# Altium project FIT_PM_Digital_Readout_test_board.PrjPcb (part 4 of 4)

## Sheet TDC_VTUNE_DAC.SchDoc: FMC 5GS/s ADC/TDC
size 420 x 297 mm; DrawnBy: A. Bartkowicz; Engineer: A. Bartkowicz; Revision: 1; SheetNumber: 8; SheetTotal: 13; ModifiedBy: -; CheckedDate: -; Title2: DAC circuit for Varicaps; DivGrp: WUT ISE; Designer: A. Bartkowicz
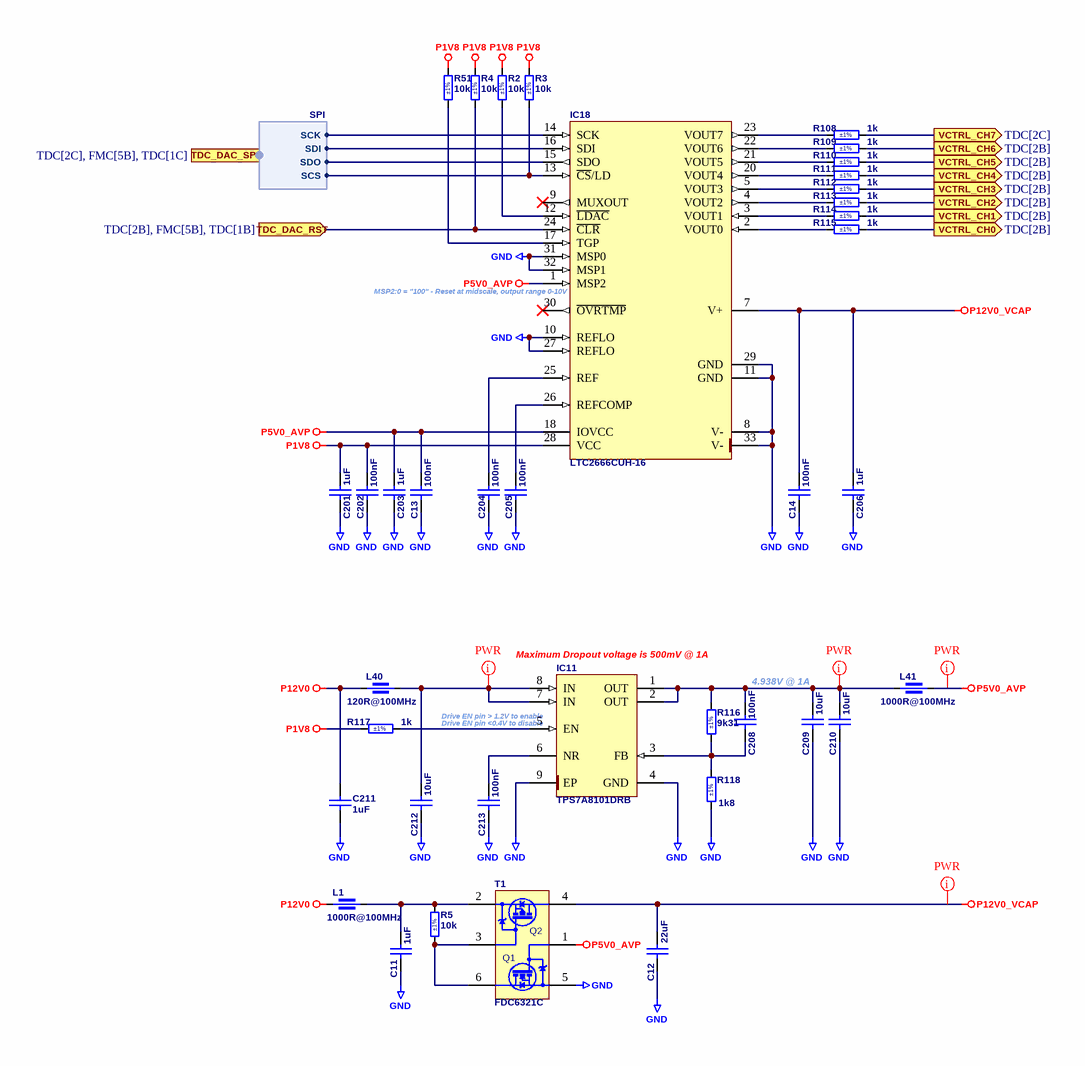
[diagram p11: TDC_VTUNE_DAC.SchDoc]

### Parts
C11  1uF  [CAPC1005X55N]
C12  22uF  [CAPC2012X135N]
C13  100nF  [CAPC1005X55N]
C14  100nF  [CAPC1005X55N]
C201  1uF  [CAPC1608X87N]
C202  100nF  [CAPC1005X55N]
C203  1uF  [CAPC1608X87N]
C204  100nF  [CAPC1005X55N]
C205  100nF  [CAPC1005X55N]
C206  1uF  [CAPC1608X87N]
C208  100nF  [CAPC1005X55N]
C209  10uF  [CAPC1608X90N]
C210  10uF  [CAPC1608X90N]
C211  1uF  [CAPC1005X55N]
C212  10uF  [CAPC1608X90N]
C213  100nF  [CAPC1005X55N]
IC11  TPS7A8101DRB  [TEXAS_DRB(S-PVSON-N8)]
IC18  LTC2666CUH-16  [QFN50P500X500X80-33N-S355]
L1  1000R@100MHz  [INDC1608X95N]
L40  120R@100MHz  [INDC1005X55N]
L41  1000R@100MHz  [INDC1608X95N]
R2  10k  Tolerance: ±1%  [RESC1005X40N]
R3  10k  Tolerance: ±1%  [RESC1005X40N]
R4  10k  Tolerance: ±1%  [RESC1005X40N]
R5  10k  Tolerance: ±1%  [RESC1005X40N]
R51  10k  Tolerance: ±1%  [RESC1005X40N]
R108  1k  Tolerance: ±1%  [RESC1005X40N]
R109  1k  Tolerance: ±1%  [RESC1005X40N]
R110  1k  Tolerance: ±1%  [RESC1005X40N]
R111  1k  Tolerance: ±1%  [RESC1005X40N]
R112  1k  Tolerance: ±1%  [RESC1005X40N]
R113  1k  Tolerance: ±1%  [RESC1005X40N]
R114  1k  Tolerance: ±1%  [RESC1005X40N]
R115  1k  Tolerance: ±1%  [RESC1005X40N]
R116  9k31  Tolerance: ±1%  [RESC1005X40N]
R117  1k  Tolerance: ±1%  [RESC1005X40N]
R118  1k8  Tolerance: ±1%  [RESC1005X40N]
T1  FDC6321C  [SOT95P280X110-6N]

### Ports
TDC_DAC_RST (in, see TDC[2B], FMC[5B], TDC[1B]), TDC_DAC_SPI (in, harness SPI, see TDC[2C], FMC[5B], TDC[1C]), VCTRL_CH0 (out, see TDC[2B]), VCTRL_CH1 (out, see TDC[2B]), VCTRL_CH2 (out, see TDC[2B]), VCTRL_CH3 (out, see TDC[2B]), VCTRL_CH4 (out, see TDC[2B]), VCTRL_CH5 (out, see TDC[2B]), VCTRL_CH6 (out, see TDC[2B]), VCTRL_CH7 (out, see TDC[2C])

### Harnesses
SPI: SDI, SDO, SCK, SCS

### Nets
GND: C11.1 C12.1 C13.1 C14.1 C201.1 C202.1 C203.1 C204.1 C205.1 C206.1 C209.1 C210.1 C211.1 C212.1 C213.1 IC11.4(GND) IC11.9(EP) IC18.8(V-) IC18.10(REFLO) IC18.11(GND) IC18.27(REFLO) IC18.29(GND) IC18.31(MSP0) IC18.32(MSP1) IC18.33(V-) R118.1 T1.5(S1)
P1V8: C201.2 C202.2 IC18.28(VCC) R2.2 R3.2 R4.2 R51.2 R117.1
P5V0_AVP: C13.2 C203.2 IC18.1(MSP2) IC18.18(IOVCC) L41.2 T1.1(G1)
P12V0: C211.2 L1.1 L40.1
P12V0_VCAP: C12.2 C14.2 C206.2 IC18.7(V+) T1.4(D2)
HA14_P: IC18.16(SDI) ; port TDC_DAC_SPI.SDI
HA15_P: IC18.15(SDO) ; port TDC_DAC_SPI.SDO
HA17_CC_P: IC18.14(SCK) ; port TDC_DAC_SPI.SCK
HA22_P: IC18.24(~{CLR}) R4.1 ; port TDC_DAC_RST
HA23_P: IC18.13(~{CS}/LD) R3.1 ; port TDC_DAC_SPI.SCS
VCTRL_A_CH: R115.2 ; port VCTRL_CH0
VCTRL_A_CH: R114.2 ; port VCTRL_CH1  [a separate net that carries the same name]
VCTRL_A_CH: R113.2 ; port VCTRL_CH2  [a separate net that carries the same name]
VCTRL_A_CH: R112.2 ; port VCTRL_CH3  [a separate net that carries the same name]
VCTRL_A_CH: R111.2 ; port VCTRL_CH4  [a separate net that carries the same name]
VCTRL_A_CH: R110.2 ; port VCTRL_CH5  [a separate net that carries the same name]
VCTRL_A_CH: R109.2 ; port VCTRL_CH6  [a separate net that carries the same name]
VCTRL_A_CH: R108.2 ; port VCTRL_CH7  [a separate net that carries the same name]
NetC11_2: C11.2 L1.2 R5.2 T1.2(S2)
NetC204_2: C204.2 IC18.25(REF)
NetC205_2: C205.2 IC18.26(REFCOMP)
NetC208_1: C208.1 IC11.3(FB) R116.1 R118.2
NetC208_2: C208.2 C209.2 C210.2 IC11.1(OUT) IC11.2(OUT) L41.1 R116.2
NetC212_2: C212.2 IC11.7(IN) IC11.8(IN) L40.2
NetC213_2: C213.2 IC11.6(NR)
NetIC11_5: IC11.5(EN) R117.2
NetIC18_2: IC18.2(VOUT0) R115.1
NetIC18_3: IC18.3(VOUT1) R114.1
NetIC18_4: IC18.4(VOUT2) R113.1
NetIC18_5: IC18.5(VOUT3) R112.1
NetIC18_12: IC18.12(~{LDAC}) R2.1
NetIC18_17: IC18.17(TGP) R51.1
NetIC18_20: IC18.20(VOUT4) R111.1
NetIC18_21: IC18.21(VOUT5) R110.1
NetIC18_22: IC18.22(VOUT6) R109.1
NetIC18_23: IC18.23(VOUT7) R108.1
NetR5_1: R5.1 T1.3(G2) T1.6(D1)

Not connected (* = marked no-connect by the designer): IC18 9(MUXOUT)* 30(~{OVRTMP})*

### Layout directives
net class PWR: NetC208_2, NetC212_2, P5V0_AVP, P12V0_VCAP

### Notes on the sheet
- (near IC18) MSP2:0 = "100" - Reset at midscale, output range 0-10V
- (near IC11) Maximum Dropout voltage is 500mV @ 1A
- 4.938V @ 1A
- (near IC11) Drive EN pin > 1.2V to enable
- (near IC11) Drive EN pin <0.4V to disable
- Project/Equipment
- Document
- Designer
- Drawn by
- Check.by
- Copyright WUT ISE 2024.
  This documentation describes Open Hardware and is licensed under the CERN OHL v.2. You may redistribute and modify this documentation under the terms of the CERN OHL v.2. (http://ohwr.org/CERNOHL). This documentation is distributed WITHOUT ANY EXPRESS OR IMPLIED WARRANTY, INCLUDING OF MERCHANTABILITY, SATISFACTORY QUALITY AND FITNESS FOR A PARTICULAR PURPOSE. Please see the CERN OHL v.2 for applicable conditions.
- Contact
- File
- Last Mod.
- Print Date
- Sheet
- Size
- A3
- of
- Rev
- (in symbol FDC6321C) Q2; Q1

### Library data of the parts
C11 C211 = CC0402_1UF_16V_10%_X5R: Non-polarised capacitor; Part Description: SMD Multilayer Chip Ceramic Capacitor; Manufacturer: GENERIC; Manufacturer1 Part Number: C1005X5R1C105KT; Voltage: 16V; TC: X5R; Tolerance: ±10%; Part Number: CC0402_1UF_16V_10%_X5R; Component Kind: Standard; Component Type: Standard; Pin Count: 2; Value: 1uF; Status: Preferred; Manufacturer Part Number: CC0402_1UF_16V_10%_X5R; Case: 0402; Mounted: Yes; Socket: No; SMD: Yes; Sense: No; Manufacturer1 Example: TDK; Manufacturer1 ComponentHeight: 0.55mm; HelpURL: \\cern.ch\dfs\Applications\Altium\Datasheets\CC0402_X5R_TDK_C.pdf; Author: CERN DEM JLC; CreateDate: 25.10.2012; LatestRevisionDate: 25.10.2012
C12 = CC0805_22UF_16V_10%_X5R: Non-polarised capacitor; Manufacturer: GENERIC; Part Description: SMD Multilayer Chip Ceramic Capacitor; Manufacturer1 Part Number: C2012X5R1C226KT; Tolerance: ±10%; Voltage: 16V; TC: X5R; Manufacturer Part Number: CC0805_22UF_16V_10%_X5R; Part Number: CC0805_22UF_16V_10%_X5R; Value: 22uF; Component Kind: Standard; Component Type: Standard; Pin Count: 2; Status: Preferred; Case: 0805; Mounted: Yes; Socket: No; SMD: Yes; Sense: No; Manufacturer1 Example: TDK; Manufacturer1 ComponentHeight: 1.35mm; HelpURL: \\cern.ch\dfs\Applications\Altium\Datasheets\CC0805_X5R_TDK_C.pdf; Author: CERN DEM JLC; CreateDate: 25.10.2012; LatestRevisionDate: 25.10.2012
C13 C14 C202 C204 C205 C208 C213 = CC0402_100NF_16V_10%_X5R: Non-polarised capacitor; Part Description: SMD Multilayer Chip Ceramic Capacitor; Manufacturer: GENERIC; Manufacturer1 Part Number: GRM155R61C104KA88D; Voltage: 16V; TC: X5R; Tolerance: ±10%; Part Number: CC0402_100NF_16V_10%_X5R; Component Kind: Standard; Component Type: Standard; Pin Count: 2; Value: 100nF; Status: None; Manufacturer Part Number: CC0402_100NF_16V_10%_X5R; Case: 0402; Mounted: Yes; Socket: No; SMD: Yes; Sense: No; Manufacturer1 Example: MURATA; Manufacturer1 ComponentHeight: 0.55mm; HelpURL: \\cern.ch\dfs\Applications\Altium\Datasheets\CC0402_X5R_MURATA_GRM.pdf; Author: CERN DEM JLC; CreateDate: 10.12.2013; LatestRevisionDate: 10.12.2013
C201 C203 C206 = CC0603_1UF_25V_10%_X7R: Non-polarised capacitor; Part Description: SMD Multilayer Chip Ceramic Capacitor; Manufacturer: GENERIC; Manufacturer1 Part Number: GRM188R71E105KA12D; Voltage: 25V; TC: X7R; Tolerance: ±10%; Part Number: CC0603_1UF_25V_10%_X7R; Component Kind: Standard; Component Type: Standard; Pin Count: 2; Value: 1uF; Status: None; Manufacturer Part Number: CC0603_1UF_25V_10%_X7R; Case: 0603; Mounted: Yes; Socket: No; SMD: Yes; Sense: No; Manufacturer1 Example: MURATA; Manufacturer1 ComponentHeight: 0.9mm; HelpURL: \\cern.ch\dfs\Applications\Altium\Datasheets\CC0603_X7R_MURATA.pdf; Author: CERN DEM JLC; CreateDate: 18.01.2011; LatestRevisionDate: 18.01.2011
C209 C210 C212 = CC0603_10UF_16V_10%_X5R_MURATA_GRT188R61C106KE13: Non-polarised capacitor; Part Description: AEC-Q200 Compliant Chip Multilayer Ceramic Capacitor; Manufacturer: MURATA; Voltage: 16V; TC: X5R; Tolerance: ±10%; Part Number: CC0603_10UF_16V_10%_X5R_MURATA_GRT188R61C106KE13; Component Kind: Standard; Component Type: Standard; Pin Count: 2; Value: 10uF; Status: None; Manufacturer Part Number: GRT188R61C106KE13; Case: 0603; Mounted: Yes; Socket: No; SMD: Yes; Sense: No; ComponentHeight: 0.9mm; HelpURL: \\cern.ch\dfs\Applications\Altium\Datasheets\CC0603_MURATA_GRT188R61C106KE13.pdf; Author: CERN DEM HF; CreateDate: 16.06.2022; LatestRevisionDate: 17.06.2022
IC11 = TPS7A8101DRB: 0.8V to 6V, 1A, Low-Noise, Wide-Bandwidth, High PSRR, Low-Dropout Linear Regulator; Manufacturer: TEXAS INSTRUMENTS; PressFit: No; Bonding: No; Part Number: TPS7A8101DRB; Component Kind: Standard; Component Type: Standard; Device: TPS7A8101DRB; PackageDescription: TEXAS Case Style DRB (S-PVSON-N8), SON, 0.65mm Pitch; 8 Pin, 3.00mm W X 3.00mm L X 1.00mm H body (w/Thermal Tab 1.60 X 1.85mm); Part Description: 0.8V to 6V, 1A, Low-Noise, Wide-Bandwidth, High PSRR, Low-Dropout Linear Regulator; Manufacturer Part Number: TPS7A8101DRB; Pin Count: 9; Case: SON8; Mounted: Yes; Socket: No; SMD: Yes; Sense: No; ComponentHeight: 1mm; HelpURL: \\cern.ch\dfs\Applications\Altium\Datasheets\TPS7A8101DRB.pdf; Author: CERN DEM BC; CreateDate: 18.02.2019; LatestRevisionDate: 18.02.2019
IC18 = LTC2666CUH-16#PBF: Octal 16-Bit, ±10V Vout, SoftSpan DAC with 10ppm/°C Max Reference; Manufacturer: LINEAR TECHNOLOGY; PressFit: No; Bonding: No; Part Number: LTC2666CUH-16#PBF; Component Kind: Standard; Component Type: Standard; Device: LTC2666CUH-16; PackageDescription: QFN, (MO-220-WHHD-X) 0.50mm Pitch, Square; 32 Pin, 5.00mm L X 5.00mm W X 0.80mm H body (w/Thermal Tab 3.55 X 3.55mm), IPC Medium Density; Part Description: Octal 16-Bit, ±10V Vout, SoftSpan DAC with 10ppm/°C Max Reference; Manufacturer Part Number: LTC2666CUH-16; Pin Count: 33; Case: QFN32; Mounted: Yes; Socket: No; SMD: Yes; Sense: No; ComponentHeight: 0.8mm; Author: CERN DEM JLC; HelpURL: \\cern.ch\dfs\Applications\Altium\Datasheets\LTC2666CUH-16#PBF.pdf; CreateDate: 22.11.2018; LatestRevisionDate: 02.02.2022
L1 L41 = IND0603_MURATA_BLM18KG102SN1: Part Description: SMD Chip Ferrite Bead, Automotive; Manufacturer: MURATA; Manufacturer Part Number: BLM18KG102WH1; Power: 1A; Resistance: 0.2R; Tolerance: ±25%; Part Number: IND0603_MURATA_BLM18KG102SN1; Component Kind: Standard; Component Type: Standard; Pin Count: 2; Value: 1000R@100MHz; Case: 0603; Mounted: Yes; Socket: No; SMD: Yes; Sense: No; ComponentHeight: 0.95mm; HelpURL: \\cern.ch\dfs\Applications\Altium\Datasheets\IND0603_MURATA_BLM18KG102SN1.pdf; Author: CERN DEM HF; CreateDate: 15.12.2022; LatestRevisionDate: 15.12.2022
L40 = IND0402_MURATA_BLM15PX121SN1D: Part Description: SMD EMIFIL Chip Ferrite Bead; Manufacturer: MURATA; Power: 2A; Resistance: 0.055R; Tolerance: ±25%; Part Number: IND0402_MURATA_BLM15PX121SN1D; Component Kind: Standard; Component Type: Standard; Pin Count: 2; Value: 120R@100MHz; Manufacturer Part Number: BLM15PX121SN1D; Case: 0402; Mounted: Yes; Socket: No; SMD: Yes; Sense: No; ComponentHeight: 0.55mm; HelpURL: \\cern.ch\dfs\Applications\Altium\Datasheets\IND0402_MURATA_BLM15PX.pdf; Author: CERN DEM JMW; CreateDate: 19.02.2014; LatestRevisionDate: 25.10.2018
R2-R5 R51 = R0402_10K_1%_0.0625W_100PPM: Resistor - 1%; Part Description: General Purpose Thick Film Chip Resistor; Manufacturer: GENERIC; Manufacturer1 Part Number: 232270671003L; TC: ±100ppm/°C; PressFit: No; Part Number: R0402_10K_1%_0.0625W_100PPM; Component Kind: Standard; Component Type: Standard; Pin Count: 2; Value: 10k; Status: Not Recommended; Power: 0.0625W; Manufacturer Part Number: R0402_10K_1%_0.0625W_100PPM; Case: 0402; Mounted: Yes; Sense: No; Socket: No; SMD: Yes; Manufacturer1 Example: YAGEO PHYCOMP; Manufacturer1 ComponentHeight: 0.4mm; HelpURL: \\cern.ch\dfs\Applications\Altium\Datasheets\R0402_Phycomp_RC0402.pdf; Author: CERN DEM JLC; CreateDate: 03.12.2007; LatestRevisionDate: 17.10.2012
R108-R115 R117 = R0402_1K_1%_0.0625W_100PPM: Resistor - 1%; Part Description: General Purpose Thick Film Chip Resistor; Manufacturer: GENERIC; Manufacturer1 Part Number: 232270671002L; TC: ±100ppm/°C; PressFit: No; Part Number: R0402_1K_1%_0.0625W_100PPM; Component Kind: Standard; Component Type: Standard; Pin Count: 2; Value: 1k; Status: Not Recommended; Power: 0.0625W; Manufacturer Part Number: R0402_1K_1%_0.0625W_100PPM; Case: 0402; Mounted: Yes; Sense: No; Socket: No; SMD: Yes; Manufacturer1 Example: YAGEO PHYCOMP; Manufacturer1 ComponentHeight: 0.4mm; HelpURL: \\cern.ch\dfs\Applications\Altium\Datasheets\R0402_Phycomp_RC0402.pdf; Author: CERN DEM JLC; CreateDate: 03.12.2007; LatestRevisionDate: 17.10.2012
R116 = R0402_9K31_1%_0.0625W_100PPM: Resistor - 1%; Part Description: General Purpose Thick Film Chip Resistor; Manufacturer: GENERIC; Manufacturer1 Part Number: 232270679312L or RC0402FR-079K31L; TC: ±100ppm/°C; PressFit: No; Part Number: R0402_9K31_1%_0.0625W_100PPM; Component Kind: Standard; Component Type: Standard; Pin Count: 2; Value: 9k31; Status: Not Recommended; Power: 0.0625W; Manufacturer Part Number: R0402_9K31_1%_0.0625W_100PPM; Case: 0402; Mounted: Yes; Sense: No; Socket: No; SMD: Yes; Manufacturer1 Example: YAGEO PHYCOMP; Manufacturer1 ComponentHeight: 0.4mm; HelpURL: \\cern.ch\dfs\Applications\Altium\Datasheets\R0402_Phycomp_RC0402.pdf; Author: CERN DEM JMW; CreateDate: 06.07.2015; LatestRevisionDate: 06.07.2015
R118 = R0402_1K8_1%_0.0625W_100PPM: Resistor - 1%; Part Description: General Purpose Thick Film Chip Resistor; Manufacturer: GENERIC; Manufacturer1 Part Number: 232270671802L; TC: ±100ppm/°C; PressFit: No; Part Number: R0402_1K8_1%_0.0625W_100PPM; Component Kind: Standard; Component Type: Standard; Pin Count: 2; Value: 1k8; Status: Not Recommended; Power: 0.0625W; Manufacturer Part Number: R0402_1K8_1%_0.0625W_100PPM; Case: 0402; Mounted: Yes; Sense: No; Socket: No; SMD: Yes; Manufacturer1 Example: YAGEO PHYCOMP; Manufacturer1 ComponentHeight: 0.4mm; HelpURL: \\cern.ch\dfs\Applications\Altium\Datasheets\R0402_Phycomp_RC0402.pdf; Author: CERN DEM JLC; CreateDate: 03.12.2007; LatestRevisionDate: 17.10.2012
T1 = FDC6321C: 25V, 680mA N-Channel, and -25V, -460mA P-Channel, Dual Digital FET; Part Description: 25V, 680mA, N-Channel, and -25V, -460mA P-Channel, Dual Digital FET; Manufacturer: ON SEMICONDUCTOR; PressFit: No; Bonding: No; Part Number: FDC6321C; Component Kind: Standard; Component Type: Standard; Device: FDC6321C; PackageDescription: SOT, 0.95mm Pitch; 6 Pin, 1.625mm W X 2.90mm L X 1.10mm H body, IPC Medium Density; Manufacturer Part Number: FDC6321C; Pin Count: 6; Case: SOT23-6; Mounted: Yes; Socket: No; SMD: Yes; Sense: No; ComponentHeight: 1mm; HelpURL: \\cern.ch\dfs\Applications\Altium\Datasheets\FDC6321C.pdf; Author: CERN DEM BC; CreateDate: 22.04.2021; LatestRevisionDate: 22.04.2021

## Sheet LOCAL_POWER.SchDoc: FMC 5GS/s ADC/TDC
size 420 x 297 mm; Author: Agnieszka Bartkowicz; CompanyName: WUT ISE; DrawnBy: Agnieszka Bartkowicz; Engineer: Agnieszka Bartkowicz; Organization: WUT ISE; Address1: PW ISE; Address2: Nowowiejska 15/19 00-665 Warsaw; Address3: gyorka@o2.pl; SheetNumber: 10; SheetTotal: 14; ModifiedBy: -; CheckedDate: -; Title2: Title 2; DivGrp: WUT ISE; Designer: A. Bartkowicz
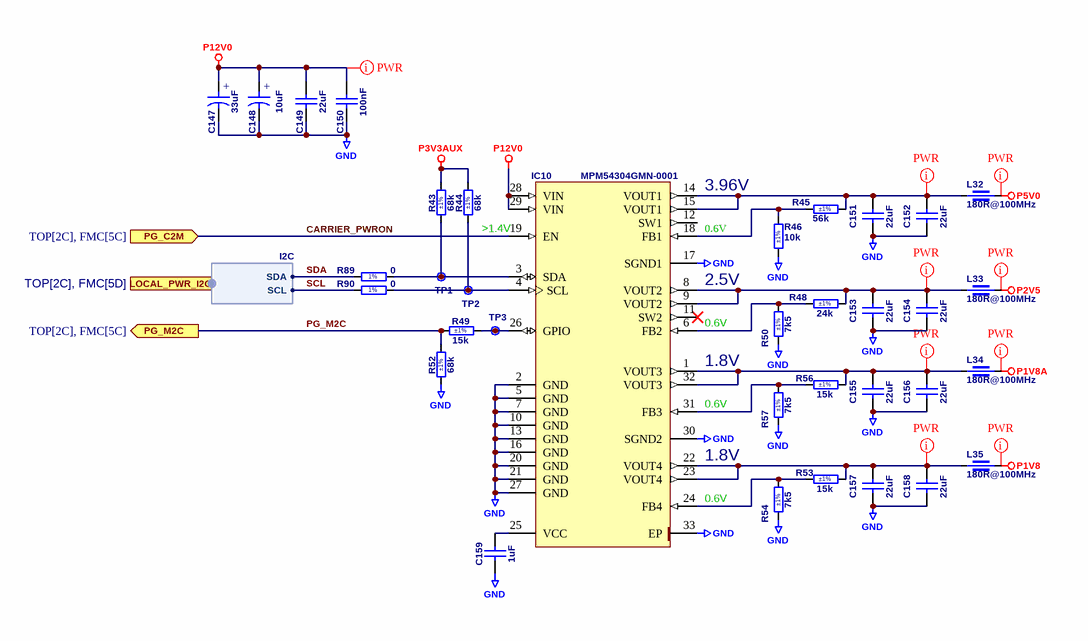
[diagram p12: LOCAL_POWER.SchDoc]

### Parts
C147  33uF  [CAPMP3528X210N]
C148  10uF  [CAPMP3216X180N]
C149  22uF  [CAPC2012X135N]
C150  100nF  [CAPC1005X55N]
C151  22uF  [CAPC2012X135N]
C152  22uF  [CAPC2012X135N]
C153  22uF  [CAPC2012X135N]
C154  22uF  [CAPC2012X135N]
C155  22uF  [CAPC2012X135N]
C156  22uF  [CAPC2012X135N]
C157  22uF  [CAPC2012X135N]
C158  22uF  [CAPC2012X135N]
C159  1uF  [CAPC1005X55N]
IC10  MPM54304GMN-0001  [MPS_MPM54304GMN]
L32  180R@100MHz  [INDC2012X105N]
L33  180R@100MHz  [INDC2012X105N]
L34  180R@100MHz  [INDC2012X105N]
L35  180R@100MHz  [INDC2012X105N]
R43  68k  Tolerance: ±1%  [RESC1005X40N]
R44  68k  Tolerance: ±1%  [RESC1005X40N]
R45  56k  Tolerance: ±1%  [RESC1005X40N]
R46  10k  Tolerance: ±1%  [RESC1005X40N]
R48  24k  Tolerance: ±1%  [RESC1005X40N]
R49  15k  Tolerance: ±1%  [RESC1005X40N]
R50  7k5  Tolerance: ±1%  [RESC1005X40N]
R52  68k  Tolerance: ±1%  [RESC1005X40N]
R53  15k  Tolerance: ±1%  [RESC1005X40N]
R54  7k5  Tolerance: ±1%  [RESC1005X40N]
R56  15k  Tolerance: ±1%  [RESC1005X40N]
R57  7k5  Tolerance: ±1%  [RESC1005X40N]
R89  0  [RESC1005X40N]
R90  0  [RESC1005X40N]
TP1  Test Point  [TPS127]  (value not drawn)  (no BOM)
TP2  Test Point  [TPS127]  (value not drawn)  (no BOM)
TP3  Test Point  [TPS127]  (value not drawn)  (no BOM)

### Ports
LOCAL_PWR_I2C (harness I2C, see TOP[2C], FMC[5D]), PG_C2M (in, see TOP[2C], FMC[5C]), PG_M2C (out, see TOP[2C], FMC[5C])

### Harnesses
I2C: SCL, SDA

### Nets
GND: C147.2 C148.2 C149.1 C150.1 C151.1 C152.1 C153.1 C154.1 C155.1 C156.1 C157.1 C158.1 C159.1 IC10.2(GND) IC10.5(GND) IC10.7(GND) IC10.10(GND) IC10.13(GND) IC10.16(GND) IC10.17(SGND1) IC10.20(GND) IC10.21(GND) IC10.27(GND) IC10.30(SGND2) IC10.33(EP) R46.1 R50.1 R52.1 R54.1 R57.1
P1V8: L35.2
P1V8A: L34.2
P2V5: L33.2
P3V3AUX: R43.2 R44.2
P5V0: L32.2
P12V0: C147.1 C148.1 C149.2 C150.2 IC10.28(VIN) IC10.29(VIN)
CARRIER_PWRON: IC10.19(EN) ; port PG_C2M
PG_M2C: R49.1 R52.2 ; port PG_M2C
SCL: R90.2 ; port LOCAL_PWR_I2C.SCL
SDA: R89.2 ; port LOCAL_PWR_I2C.SDA
NetC151_2: C151.2 C152.2 IC10.14(VOUT1) IC10.15(VOUT1) L32.1 R45.2
NetC153_2: C153.2 C154.2 IC10.8(VOUT2) IC10.9(VOUT2) L33.1 R48.2
NetC155_2: C155.2 C156.2 IC10.1(VOUT3) IC10.32(VOUT3) L34.1 R56.2
NetC157_2: C157.2 C158.2 IC10.22(VOUT4) IC10.23(VOUT4) L35.1 R53.2
NetC159_2: C159.2 IC10.25(VCC)
NetIC10_3: IC10.3(SDA) R43.1 R89.1 TP1.1
NetIC10_4: IC10.4(SCL) R44.1 R90.1 TP2.1
NetIC10_6: IC10.6(FB2) R48.1 R50.2
NetIC10_18: IC10.18(FB1) R45.1 R46.2
NetIC10_24: IC10.24(FB4) R53.1 R54.2
NetIC10_26: IC10.26(GPIO) R49.2 TP3.1
NetIC10_31: IC10.31(FB3) R56.1 R57.2

Not connected (* = marked no-connect by the designer): IC10 11(SW2)* 12(SW1)

### Layout directives
net class PWR: NetC151_2, NetC153_2, NetC155_2, NetC157_2, P1V8, P1V8A, P2V5, P5V0, P12V0

### Notes on the sheet
- 3.96V
- >1.4V
- 0.6V
- 2.5V
- 1.8V
- Project/Equipment
- Document
- Designer
- Drawn by
- Check.by
- Copyright WUT ISE 2024.
  This documentation describes Open Hardware and is licensed under the CERN OHL v.2. You may redistribute and modify this documentation under the terms of the CERN OHL v.2. (http://ohwr.org/CERNOHL). This documentation is distributed WITHOUT ANY EXPRESS OR IMPLIED WARRANTY, INCLUDING OF MERCHANTABILITY, SATISFACTORY QUALITY AND FITNESS FOR A PARTICULAR PURPOSE. Please see the CERN OHL v.2 for applicable conditions.
- Contact
- File
- Last Mod.
- Print Date
- Sheet
- Size
- A3
- of
- Rev
- (in symbol CTE3216-18_10UF_16V_20%_AVX_TCJ) +
- (in symbol CTE3528-21_33UF_16V_10%) +
- (in symbol R0402_0R_JUMPER) 1%

### Library data of the parts
C147 = CTE3528-21_33UF_16V_10%: Polarised capacitor; Part Description: Solid Tantalum Chip Capacitor; Manufacturer: GENERIC; Manufacturer1 Part Number: TAJB336K016R; Voltage: 16V; Tolerance: ±10%; Part Number: CTE3528-21_33UF_16V_10%; Component Kind: Standard; Component Type: Standard; Pin Count: 2; Value: 33uF; Status: Preferred; Manufacturer Part Number: CTE3528-21_33UF_16V_10%; Case: B; Mounted: Yes; Socket: No; SMD: Yes; Sense: No; HelpURL: \\cern.ch\dfs\Applications\Altium\Datasheets\CTE_AVX_TAJ.pdf; Author: CERN DEM JLC; CreateDate: 03.12.2007; LatestRevisionDate: 03.12.2007; Manufacturer1 Example: AVX; Manufacturer1 ComponentHeight: 2.1mm
C148 = CTE3216-18_10UF_16V_20%_AVX_TCJ: Polarised capacitor; Part Description: ESR 0R200 Tantalum Solid Electrolytic Chip Capacitor with Conductive Polymer Electrode; Manufacturer: AVX; Manufacturer Part Number: TCJA106M016R0200; Voltage: 16V; Tolerance: ±20%; Part Number: CTE3216-18_10UF_16V_20%_AVX_TCJ; Component Kind: Standard; Component Type: Standard; Pin Count: 2; Value: 10uF; Status: Preferred; Case: A; Mounted: Yes; Socket: No; SMD: Yes; Sense: No; ComponentHeight: 1.8mm; HelpURL: \\cern.ch\dfs\Applications\Altium\Datasheets\CTE_AVX_TCJ.pdf; Author: CERN DEM JLC; CreateDate: 29.03.2012; LatestRevisionDate: 29.03.2012
C149 C151-C158 = CC0805_22UF_16V_10%_X5R: as C12 on sheet TDC_VTUNE_DAC; Manufacturer Part Number: CC0805_22UF_16V_10%_X5R; Part Number: CC0805_22UF_16V_10%_X5R; Value: 22uF; Component Kind: Standard; Component Type: Standard; Pin Count: 2; Status: Preferred; Case: 0805; Mounted: Yes; Socket: No; SMD: Yes; Sense: No; Manufacturer1 Example: TDK; Manufacturer1 ComponentHeight: 1.35mm; HelpURL: \\cern.ch\dfs\Applications\Altium\Datasheets\CC0805_X5R_TDK_C.pdf; Author: CERN DEM JLC; CreateDate: 25.10.2012; LatestRevisionDate: 25.10.2012
C150 = CC0402_100NF_16V_10%_X7R: Non-polarised capacitor; Part Description: SMD Multilayer Chip Ceramic Capacitor; Manufacturer: GENERIC; Manufacturer1 Part Number: GRM155R71C104KA88D; Voltage: 16V; TC: X7R; Tolerance: ±10%; Part Number: CC0402_100NF_16V_10%_X7R; Component Kind: Standard; Component Type: Standard; Pin Count: 2; Value: 100nF; Status: Not Recommended; Manufacturer Part Number: CC0402_100NF_16V_10%_X7R; Case: 0402; Mounted: Yes; Socket: No; SMD: Yes; Sense: No; Manufacturer1 Example: MURATA; Manufacturer1 ComponentHeight: 0.55mm; HelpURL: \\cern.ch\dfs\Applications\Altium\Datasheets\CC0402_X7R_MURATA_GRM.pdf; Author: CERN DEM JLC; CreateDate: 05/12/2013; LatestRevisionDate: 03/12/2007
C159 = CC0402_1UF_16V_10%_X5R: as C11 on sheet TDC_VTUNE_DAC; Part Number: CC0402_1UF_16V_10%_X5R; Component Kind: Standard; Component Type: Standard; Pin Count: 2; Value: 1uF; Status: Preferred; Manufacturer Part Number: CC0402_1UF_16V_10%_X5R; Case: 0402; Mounted: Yes; Socket: No; SMD: Yes; Sense: No; Manufacturer1 Example: TDK; Manufacturer1 ComponentHeight: 0.55mm; HelpURL: \\cern.ch\dfs\Applications\Altium\Datasheets\CC0402_X5R_TDK_C.pdf; Author: CERN DEM JLC; CreateDate: 25.10.2012; LatestRevisionDate: 25.10.2012
IC10 = MPM54304GMN-XXXX: Quad-Output Power Module with I2C and MTP; Part Description: 4V to 16V Input, Quad-Output Power Module with I2C and MTP; Manufacturer: MPS (MONOLITIC  POWER SYSTEMS); Manufacturer Part Number: MPM54304GMN-002; PressFit: No; Bonding: No; Part Number: MPM54304GMN-0001; Component Kind: Standard; Component Type: Standard; Device: MPM54304GMN-0001; PackageDescription: MPS LGA-33 Case, 0.65mm Pitch, Rect.; 32 Pin, 7.00mm L X 7.00mm W X 2.10mm H body (w/Thermal Tab 3.55 X 3.55mm); Pin Count: 33; Case: QFN32; Mounted: Yes; Socket: No; SMD: Yes; Sense: No; ComponentHeight: 2.1mm; HelpURL: \\cern.ch\dfs\Applications\Altium\Datasheets\MPM54304GMN.pdf; Author: CERN DEM BC; CreateDate: 09.11.2020; LatestRevisionDate: 23.11.2022
L32-L35 = IND0805_MURATA_BLM21SP181BH1D: Part Description: SMD EMIFIL Chip Ferrite Bead; Manufacturer: MURATA; Power: 4A; Resistance: 0.02R; Tolerance: ±25%; Part Number: IND0805_MURATA_BLM21SP181BH1D; Component Kind: Standard; Component Type: Standard; Pin Count: 2; Value: 180R@100MHz; Manufacturer Part Number: BLM21SP181BH1; Case: 0805; Mounted: Yes; Socket: No; SMD: Yes; Sense: No; ComponentHeight: 1.05mm; HelpURL: \\cern.ch\dfs\Applications\Altium\Datasheets\IND0805_MURATA_BLM21SP181BH1.pdf; Author: CERN DEM JMW; CreateDate: 30.07.2021; LatestRevisionDate: 30.07.2021
R43 R44 R52 = R0402_68K_1%_0.0625W_100PPM: Resistor - 1%; Part Description: General Purpose Thick Film Chip Resistor; Manufacturer: GENERIC; Manufacturer1 Part Number: 232270676803L; TC: ±100ppm/°C; PressFit: No; Part Number: R0402_68K_1%_0.0625W_100PPM; Component Kind: Standard; Component Type: Standard; Pin Count: 2; Value: 68k; Status: Not Recommended; Power: 0.0625W; Manufacturer Part Number: R0402_68K_1%_0.0625W_100PPM; Case: 0402; Mounted: Yes; Sense: No; Socket: No; SMD: Yes; Manufacturer1 Example: YAGEO PHYCOMP; Manufacturer1 ComponentHeight: 0.4mm; HelpURL: \\cern.ch\dfs\Applications\Altium\Datasheets\R0402_Phycomp_RC0402.pdf; Author: CERN DEM JLC; CreateDate: 03.12.2007; LatestRevisionDate: 17.10.2012
R45 = R0402_56K_1%_0.0625W_100PPM: Resistor - 1%; Part Description: General Purpose Thick Film Chip Resistor; Manufacturer: GENERIC; Manufacturer1 Part Number: 232270675603L; TC: ±100ppm/°C; PressFit: No; Part Number: R0402_56K_1%_0.0625W_100PPM; Component Kind: Standard; Component Type: Standard; Pin Count: 2; Value: 56k; Status: Not Recommended; Power: 0.0625W; Manufacturer Part Number: R0402_56K_1%_0.0625W_100PPM; Case: 0402; Mounted: Yes; Sense: No; Socket: No; SMD: Yes; Manufacturer1 Example: YAGEO PHYCOMP; Manufacturer1 ComponentHeight: 0.4mm; HelpURL: \\cern.ch\dfs\Applications\Altium\Datasheets\R0402_Phycomp_RC0402.pdf; Author: CERN DEM JLC; CreateDate: 03.12.2007; LatestRevisionDate: 17.10.2012
R46 = R0402_10K_1%_0.0625W_100PPM: as R2-R5 on sheet TDC_VTUNE_DAC; Part Number: R0402_10K_1%_0.0625W_100PPM; Component Kind: Standard; Component Type: Standard; Pin Count: 2; Value: 10k; Status: Not Recommended; Power: 0.0625W; Manufacturer Part Number: R0402_10K_1%_0.0625W_100PPM; Case: 0402; Mounted: Yes; Sense: No; Socket: No; SMD: Yes; Manufacturer1 Example: YAGEO PHYCOMP; Manufacturer1 ComponentHeight: 0.4mm; HelpURL: \\cern.ch\dfs\Applications\Altium\Datasheets\R0402_Phycomp_RC0402.pdf; Author: CERN DEM JLC; CreateDate: 03.12.2007; LatestRevisionDate: 17.10.2012
R48 = R0402_24K_1%_0.0625W_100PPM: Resistor - 1%; Part Description: General Purpose Thick Film Chip Resistor; Manufacturer: GENERIC; Manufacturer1 Part Number: 232270672403L; TC: ±100ppm/°C; PressFit: No; Part Number: R0402_24K_1%_0.0625W_100PPM; Component Kind: Standard; Component Type: Standard; Pin Count: 2; Value: 24k; Status: Not Recommended; Power: 0.0625W; Manufacturer Part Number: R0402_24K_1%_0.0625W_100PPM; Case: 0402; Mounted: Yes; Sense: No; Socket: No; SMD: Yes; Manufacturer1 Example: YAGEO PHYCOMP; Manufacturer1 ComponentHeight: 0.4mm; HelpURL: \\cern.ch\dfs\Applications\Altium\Datasheets\R0402_Phycomp_RC0402.pdf; Author: CERN DEM JLC; CreateDate: 03.12.2007; LatestRevisionDate: 17.10.2012
R49 R53 R56 = R0402_15K_1%_0.0625W_100PPM: Resistor - 1%; Part Description: General Purpose Thick Film Chip Resistor; Manufacturer: GENERIC; Manufacturer1 Part Number: CRCW040215K0FK; TC: ±100ppm/°C; PressFit: No; Part Number: R0402_15K_1%_0.0625W_100PPM; Component Kind: Standard; Component Type: Standard; Pin Count: 2; Value: 15k; Status: Preferred; Power: 0.0625W; Manufacturer Part Number: R0402_15K_1%_0.0625W_100PPM; Case: 0402; Mounted: Yes; Sense: No; Socket: No; SMD: Yes; Manufacturer1 Example: VISHAY; Manufacturer1 ComponentHeight: 0.4mm; HelpURL: \\cern.ch\dfs\Applications\Altium\Datasheets\R0402_VISHAY_CRCW e3.pdf; Author: CERN DEM JMW; CreateDate: 06.07.2015; LatestRevisionDate: 06.07.2015
R50 R54 R57 = R0402_7K5_1%_0.0625W_100PPM: Resistor - 1%; Part Description: General Purpose Thick Film Chip Resistor; Manufacturer: GENERIC; Manufacturer1 Part Number: 232270677502L; TC: ±100ppm/°C; PressFit: No; Part Number: R0402_7K5_1%_0.0625W_100PPM; Component Kind: Standard; Component Type: Standard; Pin Count: 2; Value: 7k5; Status: Not Recommended; Power: 0.0625W; Manufacturer Part Number: R0402_7K5_1%_0.0625W_100PPM; Case: 0402; Mounted: Yes; Sense: No; Socket: No; SMD: Yes; Manufacturer1 Example: YAGEO PHYCOMP; Manufacturer1 ComponentHeight: 0.4mm; HelpURL: \\cern.ch\dfs\Applications\Altium\Datasheets\R0402_Phycomp_RC0402.pdf; Author: CERN DEM JLC; CreateDate: 03.12.2007; LatestRevisionDate: 17.10.2012
R89 R90 = R0402_0R_JUMPER: Resistor - 1%; Part Description: 1A (0.05R Max DC Resistance) Zero Ohm Jumper; Manufacturer: GENERIC; Manufacturer1 Part Number: 232270591001; Table: Resistors SMD; Part Number: R0402_0R_JUMPER; Component Kind: Standard; Component Type: Standard; Pin Count: 2; Value: 0; Status: Not recommended; Manufacturer Part Number: R0402_0R_JUMPER; Case: 0402; Mounted: Yes; Socket: No; SMD: Yes; Manufacturer1 Example: PHYCOMP; Manufacturer1 ComponentHeight: 0.4mm; HelpURL: \\cern.ch\dfs\Applications\Altium\Datasheets\R0402_Phycomp_RC0402.pdf; Author: CERN DEM JLC; CreateDate: 2007-12-03; LatestRevisionDate: 2008-03-13
TP1-TP3 = SMD_PAD_1.27X1.27MM: Part Description: 1.27mm x 1.27mm PCB Copper Area (SMD Test Point); Mounted: No; Part Number: SMD_PAD_1.27X1.27MM; Component Type: Standard (No BOM); Pin Count: 1; Family: Test Point; Socket: No; SMD: Yes; Sense: No; Status: None; ComponentHeight: 0mm; HelpURL: Undefined; Author: CERN DEM JLC; CreateDate: 12.01.2008; LatestRevisionDate: 12.01.2008; PackageDescription: 1.27mm x 1.27mm PCB Copper Area (SMD Test Point)

## Sheet USB_UART.SchDoc: FMC 5GS/s ADC/TDC
size 420 x 297 mm; Author: Agnieszka Bartkowicz; CompanyName: WUT ISE; DrawnBy: Agnieszka Bartkowicz; Engineer: Agnieszka Bartkowicz; Organization: WUT ISE; Address1: PW ISE; Address2: Nowowiejska 15/19 00-665 Warsaw; Address3: gyorka@o2.pl; Revision: 2; SheetNumber: 13; SheetTotal: 14; ModifiedBy: -; CheckedDate: -; Title2: FIT PM Digital Readout test board; DivGrp: WUT ISE; Designer: A. Bartkowicz; ModifiedDate: -; ProjectName: Sensor Box
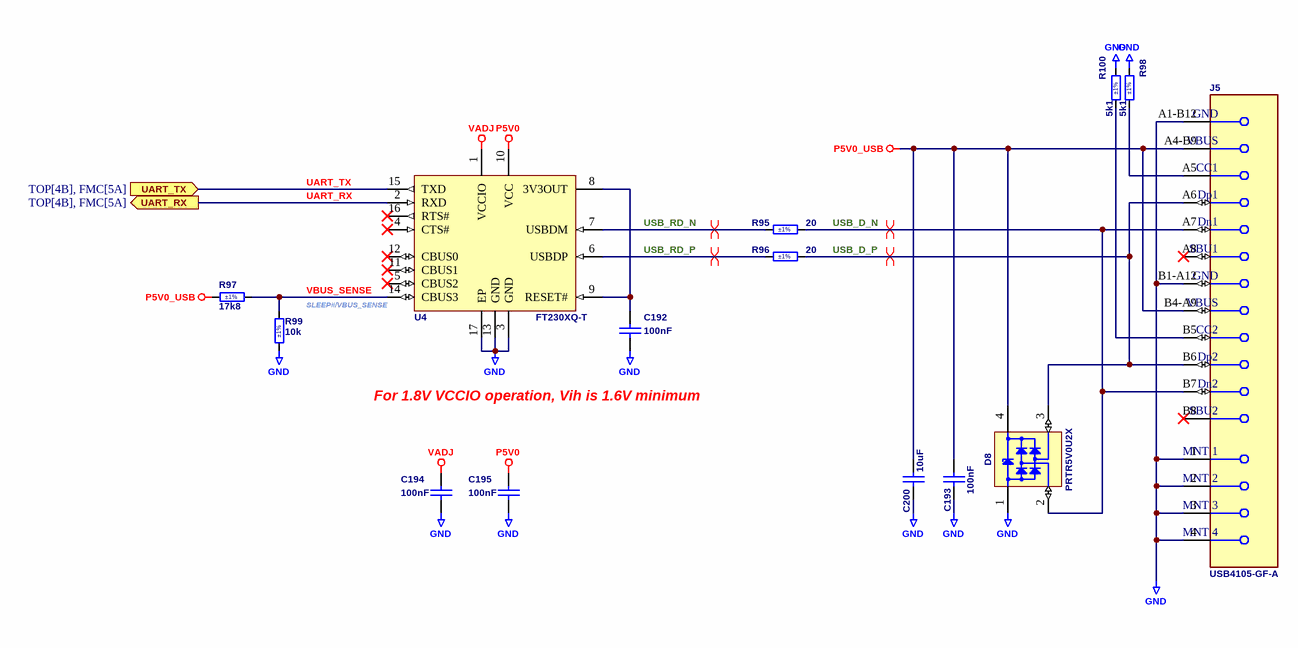
[diagram p13: USB_UART.SchDoc]

### Parts
C192  100nF  [CAPC1005X55N]
C193  100nF  [CAPC1005X55N]
C194  100nF  [CAPC1005X55N]
C195  100nF  [CAPC1005X55N]
C200  10uF  [CAPC1608X90N]
D8  PRTR5V0U2X  [SOT190P230X110-4N]
J5  USB4105-GF-A  [FP-USB4105-GF-A-MFG]
R95  20  Tolerance: ±1%  [RESC1005X40N]
R96  20  Tolerance: ±1%  [RESC1005X40N]
R97  17k8  Tolerance: ±1%  [RESC1005X40N]
R98  5k1  Tolerance: ±1%  [RESC1005X40N]
R99  10k  Tolerance: ±1%  [RESC1005X40N]
R100  5k1  Tolerance: ±1%  [RESC1005X40N]
U4  FT230XQ-T  [QFN50P400X400X80_HS-17N]

### Ports
UART_RX (out, see TOP[4B], FMC[5A]), UART_TX (in, see TOP[4B], FMC[5A])

### Nets
GND: C192.1 C193.1 C194.1 C195.1 C200.1 D8.1(GND) J5.1(MNT_1) J5.2(MNT_2) J5.3(MNT_3) J5.4(MNT_4) J5.A1-B12(GND) J5.B1-A12(GND) R98.2 R99.1 R100.2 U4.3(GND) U4.13(GND) U4.17(EP)
P5V0: C195.2 U4.10(VCC)
P5V0_USB: C193.2 C200.2 D8.4(VCC) J5.A4-B9(VBUS) J5.B4-A9(VBUS) R97.1
VADJ: C194.2 U4.1(VCCIO)
UART_RX: U4.2(RXD) ; port UART_RX  [project net LA20_P]
UART_TX: U4.15(TXD) ; port UART_TX  [project net LA25_P]
USB_D_N: D8.2(I/O1) J5.A7(Dn1) J5.B7(Dn2) R95.2
USB_D_P: D8.3(I/O2) J5.A6(Dp1) J5.B6(Dp2) R96.2
USB_RD_N: R95.1 U4.7(USBDM)
USB_RD_P: R96.1 U4.6(USBDP)
VBUS_SENSE: R97.2 R99.2 U4.14(CBUS3)
NetC192_2: C192.2 U4.8(3V3OUT) U4.9(RESET#)
NetJ5_A5: J5.A5(CC1) R98.1
NetJ5_B5: J5.B5(CC2) R100.1

Not connected (* = marked no-connect by the designer): J5 A8(SBU1)* B8(SBU2)*; U4 4(CTS#)* 5(CBUS2)* 11(CBUS1)* 12(CBUS0)* 16(RTS#)*

### Layout directives
differential pair: USB_D_N, USB_D_P, USB_RD_N, USB_RD_P

### Notes on the sheet
- SLEEP#/VBUS_SENSE
- For 1.8V VCCIO operation, Vih is 1.6V minimum
- Project/Equipment
- Document
- Designer
- Drawn by
- Check.by
- Copyright WUT ISE 2024.
  This documentation describes Open Hardware and is licensed under the CERN OHL v.2. You may redistribute and modify this documentation under the terms of the CERN OHL v.2. (http://ohwr.org/CERNOHL). This documentation is distributed WITHOUT ANY EXPRESS OR IMPLIED WARRANTY, INCLUDING OF MERCHANTABILITY, SATISFACTORY QUALITY AND FITNESS FOR A PARTICULAR PURPOSE. Please see the CERN OHL v.2 for applicable conditions.
- Contact
- File
- Last Mod.
- Print Date
- Sheet
- Size
- A3
- of
- Rev

### Library data of the parts
C192 C194 C195 = CC0402_100NF_50V_10%_X7R: Non-polarised capacitor; Part Description: SMD Multilayer Chip Ceramic Capacitor; Manufacturer: GENERIC; Manufacturer1 Part Number: GRM155R71H104KE14D; Voltage: 50V; TC: X7R; Tolerance: ±10%; Part Number: CC0402_100NF_50V_10%_X7R; Component Kind: Standard; Component Type: Standard; Pin Count: 2; Value: 100nF; Status: None; Manufacturer Part Number: CC0402_100NF_50V_10%_X7R; Case: 0402; Mounted: Yes; Socket: No; SMD: Yes; Sense: No; Manufacturer1 Example: MURATA; Manufacturer1 ComponentHeight: 0.55mm; HelpURL: \\cern.ch\dfs\Applications\Altium\Datasheets\CC0402_MURATA_GRM155R71H104KE14D.pdf; Author: CERN DEM MR; CreateDate: 30.06.2017; LatestRevisionDate: 30.06.2017
C193 = CC0402_100NF_16V_10%_X7R: as C150 on sheet LOCAL_POWER; Part Number: CC0402_100NF_16V_10%_X7R; Component Kind: Standard; Component Type: Standard; Pin Count: 2; Value: 100nF; Status: Not Recommended; Manufacturer Part Number: CC0402_100NF_16V_10%_X7R; Case: 0402; Mounted: Yes; Socket: No; SMD: Yes; Sense: No; Manufacturer1 Example: MURATA; Manufacturer1 ComponentHeight: 0.55mm; HelpURL: \\cern.ch\dfs\Applications\Altium\Datasheets\CC0402_X7R_MURATA_GRM.pdf; Author: CERN DEM JLC; CreateDate: 05/12/2013; LatestRevisionDate: 03/12/2007
C200 = CC0603_10UF_16V_10%_X5R_MURATA_GRT188R61C106KE13: as C209 on sheet TDC_VTUNE_DAC; Part Number: CC0603_10UF_16V_10%_X5R_MURATA_GRT188R61C106KE13; Component Kind: Standard; Component Type: Standard; Pin Count: 2; Value: 10uF; Status: None; Manufacturer Part Number: GRT188R61C106KE13; Case: 0603; Mounted: Yes; Socket: No; SMD: Yes; Sense: No; ComponentHeight: 0.9mm; HelpURL: \\cern.ch\dfs\Applications\Altium\Datasheets\CC0603_MURATA_GRT188R61C106KE13.pdf; Author: CERN DEM HF; CreateDate: 16.06.2022; LatestRevisionDate: 17.06.2022
D8 = PRTR5V0U2X: Ultra Low Capacitance Double Rail-to-Rail ESD Protection Diode; Part Description: Ultra Low Capacitance (1pF) Double Rail-to-Rail ESD Protection Diode (8kV); Manufacturer: NXP SEMICONDUCTORS; Voltage: 5.5V; PressFit: No; Bonding: No; Part Number: PRTR5V0U2X; Component Kind: Standard; Component Type: Standard; Device: PRTR5V0U2X; PackageDescription: SOT143B, SOT, 1.90mm Pitch; 4 Pin, 1.30mm W X 2.90mm L X 1.10mm H body, IPC Medium Density; Manufacturer Part Number: PRTR5V0U2X; Pin Count: 4; Case: SOT143B; Mounted: Yes; Socket: No; SMD: Yes; Sense: No; ComponentHeight: 1.1mm; HelpURL: \\cern.ch\dfs\Applications\Altium\Datasheets\PRTR5V0U2X.pdf; Author: CERN DEM JLC; CreateDate: 22.03.2011; LatestRevisionDate: 22.03.2011
J5 = e7c17a616881a82b79941196b4bec10: CONN RCPT USB2.0 TYPEC 5A; Manufacturer: GCT; Voltage Rating: 20V; Is Female: yes; Current Rating: 5/6.25/1.25/0.25A; Number Of Contacts: 16; Conn Orientation: Right Angle; Device Class L1: Connectors; Category: Conn; Lead Free: Yes; RoHS: TRUE; Temperature Range High: +85°C; Digikey Description: CONN RCPT USB2.0 TYPEC 5A; Device Class L3: unset; ComponentLink2Description: Datasheet; Manufacturer Part Number: USB4105-GF-A; Package: 0; Usb Standard: USB 2.0; Device Class L2: USB Connectors; Automotive: No; Temperature Range Low: -40°C; Height: 3.46mm; Temperature: -40°C to +85°C; Contact Material: Gold,Nickel; ComponentLink2URL: https://gct.co/files/drawings/usb4105.pdf; Octopart: https://octopart.com/usb4105-gf-a-gct-106627878
R95 R96 = R0402_20R_1%_0.0625W_100PPM: Resistor - 1%; Part Description: General Purpose Thick Film Chip Resistor; Manufacturer: GENERIC; Manufacturer1 Part Number: 232270672009L; TC: ±100ppm/°C; PressFit: No; Part Number: R0402_20R_1%_0.0625W_100PPM; Component Kind: Standard; Component Type: Standard; Pin Count: 2; Value: 20; Status: Not Recommended; Power: 0.0625W; Manufacturer Part Number: R0402_20R_1%_0.0625W_100PPM; Case: 0402; Mounted: Yes; Sense: No; Socket: No; SMD: Yes; Manufacturer1 Example: YAGEO PHYCOMP; Manufacturer1 ComponentHeight: 0.4mm; HelpURL: \\cern.ch\dfs\Applications\Altium\Datasheets\R0402_Phycomp_RC0402.pdf; Author: CERN DEM JLC; CreateDate: 03.12.2007; LatestRevisionDate: 17.10.2012
R97 = R0402_17K8_1%_0.0625W_100PPM: Resistor - 1%; Part Description: General Purpose Thick Film Chip Resistor; Manufacturer: GENERIC; Manufacturer1 Part Number: RC0402FR-0717K8L; TC: ±100ppm/°C; PressFit: No; Part Number: R0402_17K8_1%_0.0625W_100PPM; Component Kind: Standard; Component Type: Standard; Pin Count: 2; Value: 17k8; Status: Preferred; Power: 0.0625W; Manufacturer Part Number: R0402_17K8_1%_0.0625W_100PPM; Case: 0402; Mounted: Yes; Sense: No; Socket: No; SMD: Yes; Manufacturer1 Example: YAGEO PHYCOMP; Manufacturer1 ComponentHeight: 0.4mm; HelpURL: \\cern.ch\dfs\Applications\Altium\Datasheets\R0402_YAGEO_RC_L.pdf; Author: CERN DEM BC; CreateDate: 16.03.2021; LatestRevisionDate: 16.03.2021
R98 R100 = R0402_5K1_1%_0.0625W_100PPM: Resistor - 1%; Part Description: General Purpose Thick Film Chip Resistor; Manufacturer: GENERIC; Manufacturer1 Part Number: 232270675102L; TC: ±100ppm/°C; PressFit: No; Part Number: R0402_5K1_1%_0.0625W_100PPM; Component Kind: Standard; Component Type: Standard; Pin Count: 2; Value: 5k1; Status: Not Recommended; Power: 0.0625W; Manufacturer Part Number: R0402_5K1_1%_0.0625W_100PPM; Case: 0402; Mounted: Yes; Sense: No; Socket: No; SMD: Yes; Manufacturer1 Example: YAGEO PHYCOMP; Manufacturer1 ComponentHeight: 0.4mm; HelpURL: \\cern.ch\dfs\Applications\Altium\Datasheets\R0402_Phycomp_RC0402.pdf; Author: CERN DEM JLC; CreateDate: 03.12.2007; LatestRevisionDate: 17.10.2012
R99 = R0402_10K_1%_0.0625W_100PPM: as R2-R5 on sheet TDC_VTUNE_DAC; Part Number: R0402_10K_1%_0.0625W_100PPM; Component Kind: Standard; Component Type: Standard; Pin Count: 2; Value: 10k; Status: Not Recommended; Power: 0.0625W; Manufacturer Part Number: R0402_10K_1%_0.0625W_100PPM; Case: 0402; Mounted: Yes; Sense: No; Socket: No; SMD: Yes; Manufacturer1 Example: YAGEO PHYCOMP; Manufacturer1 ComponentHeight: 0.4mm; HelpURL: \\cern.ch\dfs\Applications\Altium\Datasheets\R0402_Phycomp_RC0402.pdf; Author: CERN DEM JLC; CreateDate: 03.12.2007; LatestRevisionDate: 17.10.2012
U4 = FT230XQ-T: USB to Basic UART Interface Chip, UHCI/OHCI/EHCI Compatible, USB 2.0 Compatible, -40 to +85 degC, 16-Pin QFN, Pb-Free, Tray; Manufacturer: FTDI; DatasheetVersion: ver 1.2, Feb-2013; PackageVersion: Feb-13; PackageReference: QFN-16; PackageDescription: 16-Pin Quad Flat No-Lead, 4x4 mm Body, 0.65 mm Pitch; Code_JEDEC: MO-220WGGC; PartNumber: FT230XQ-T; ComponentLink1Description: Manufacturer URL; ComponentLink1URL: http://www.ftdichip.com/; ComponentLink2Description: Datasheet; ComponentLink2URL: http://www.ftdichip.com/Support/Documents/DataSheets/ICs/DS_FT230X.pdf; ComponentLink3Description: FT230X Product Page; ComponentLink3URL: www.ftdichip.com/Products/ICs/FT230X.html

## Nets that join several sheets
GND: TOP (J2.2), ADC5G_POWER (150 pins), ADC5G_FRONTEND (29 pins), ADC5G_PLL (69 pins), FMC (160 pins), FMC_EEPROM (13 pins), TDC (15 pins), U_TDC/TDC_DL_CH1 (C188A.1 C189A.1 R42A.1 R47A.1), U_TDC/TDC_DL_CH2 (C188B.1 C189B.1 R42B.1 R47B.1), U_TDC/TDC_DL_CH3 (C188C.1 C189C.1 R42C.1 R47C.1), U_TDC/TDC_DL_CH4 (C188D.1 C189D.1 R42D.1 R47D.1), U_TDC/TDC_DL_CH5 (C188E.1 C189E.1 R42E.1 R47E.1), U_TDC/TDC_DL_CH6 (C188F.1 C189F.1 R42F.1 R47F.1), U_TDC/TDC_DL_CH7 (C188G.1 C189G.1 R42G.1 R47G.1), U_TDC/TDC_DL_CH8 (C188H.1 C189H.1 R42H.1 R47H.1), TDC_VTUNE_DAC (27 pins), LOCAL_POWER (30 pins), USB_UART (18 pins)
P1V8: ADC5G_POWER (23 pins), ADC5G_FRONTEND (R17.1 R18.1), ADC5G_PLL (6 pins), TDC_VTUNE_DAC (8 pins), LOCAL_POWER (L35.2)
P1V8A: ADC5G_POWER (C198.2 L38.1), LOCAL_POWER (L34.2)
P2V5: ADC5G_POWER (C197.2 L37.1), ADC5G_FRONTEND (C173.2 L27.1), TDC (18 pins), LOCAL_POWER (L33.2)
P3V3AUX: FMC (J4.d32), FMC_EEPROM (9 pins), LOCAL_POWER (R43.2 R44.2)
P5V0: ADC5G_FRONTEND (C196.2 L36.1 R86.2 R88.2), ADC5G_PLL (C160.2 C199.2 L39.1 L42.1), LOCAL_POWER (L32.2), USB_UART (C195.2 U4.10)
P12V0: FMC (J4.c35 J4.c37), TDC_VTUNE_DAC (C211.2 L1.1 L40.1), LOCAL_POWER (6 pins)
VADJ: FMC (J4.e39 J4.f40 J4.g39 J4.h40), FMC_EEPROM (R78.2), USB_UART (C194.2 U4.1)
ADC_SCS: ADC5G_FRONTEND (IC2.R8 R17.2), FMC (J4.h22)
SYNCSE: ADC5G_FRONTEND (IC2.E2), FMC (J4.j27)
ADC_CLK_N: ADC5G_FRONTEND (IC2.J1), ADC5G_PLL (C103.2)
ADC_CLK_P: ADC5G_FRONTEND (IC2.H1), ADC5G_PLL (C101.2)
ADC_PD: ADC5G_FRONTEND (IC2.R1 R18.2), FMC (J4.f28)
ADC_SCK: ADC5G_FRONTEND (IC2.T8), FMC (J4.g18)
ADC_SDI: ADC5G_FRONTEND (IC2.P8), FMC (J4.c18)
ADC_SDO: ADC5G_FRONTEND (IC2.N8), FMC (J4.h19)
AIN_N: TOP (J1.2), ADC5G_FRONTEND (R8.1)
AIN_P: TOP (J1.1), ADC5G_FRONTEND (R11.1)
CALSTAT: ADC5G_FRONTEND (IC2.B1), FMC (J4.j36)
CALTRIG: ADC5G_FRONTEND (IC2.B2), FMC (J4.k31)
CARRIER_PWRON: FMC (J4.d1), LOCAL_POWER (IC10.19)
CLK0_M2C_N: ADC5G_PLL (C99.2), FMC (J4.h5)
CLK0_M2C_P: ADC5G_PLL (C98.2), FMC (J4.h4)
CLK1_M2C_N: ADC5G_PLL (C97.2), FMC (J4.g3)
CLK1_M2C_P: ADC5G_PLL (C96.2), FMC (J4.g2)
CLK2_BIDIR_N: ADC5G_PLL (C108.2), FMC (J4.k5)
CLK2_BIDIR_P: ADC5G_PLL (C107.2), FMC (J4.k4)
DA_CLK_N: ADC5G_DIGITALIO (IC2.G10), FMC (J4.g7)
DA_CLK_P: ADC5G_DIGITALIO (IC2.G9), FMC (J4.g6)
DA_D0_N: ADC5G_DIGITALIO (IC2.A10), FMC (J4.d12)
DA_D0_P: ADC5G_DIGITALIO (IC2.A9), FMC (J4.d11)
DA_D1_N: ADC5G_DIGITALIO (IC2.B10), FMC (J4.h11)
DA_D1_P: ADC5G_DIGITALIO (IC2.B9), FMC (J4.h10)
DA_D2_N: ADC5G_DIGITALIO (IC2.C10), FMC (J4.g10)
DA_D2_P: ADC5G_DIGITALIO (IC2.C9), FMC (J4.g9)
DA_D3_N: ADC5G_DIGITALIO (IC2.D10), FMC (J4.c11)
DA_D3_P: ADC5G_DIGITALIO (IC2.D9), FMC (J4.c10)
DA_D4_N: ADC5G_DIGITALIO (IC2.E10), FMC (J4.h8)
DA_D4_P: ADC5G_DIGITALIO (IC2.E9), FMC (J4.h7)
DA_D5_N: ADC5G_DIGITALIO (IC2.F10), FMC (J4.g13)
DA_D5_P: ADC5G_DIGITALIO (IC2.F9), FMC (J4.g12)
DA_D6_N: ADC5G_DIGITALIO (IC2.A12), FMC (J4.h14)
DA_D6_P: ADC5G_DIGITALIO (IC2.A11), FMC (J4.h13)
DA_D7_N: ADC5G_DIGITALIO (IC2.B12), FMC (J4.d15)
DA_D7_P: ADC5G_DIGITALIO (IC2.B11), FMC (J4.d14)
DA_D8_N: ADC5G_DIGITALIO (IC2.C12), FMC (J4.g16)
DA_D8_P: ADC5G_DIGITALIO (IC2.C11), FMC (J4.g15)
DA_D9_N: ADC5G_DIGITALIO (IC2.D12), FMC (J4.h17)
DA_D9_P: ADC5G_DIGITALIO (IC2.D11), FMC (J4.h16)
DA_D10_N: ADC5G_DIGITALIO (IC2.E12), FMC (J4.c15)
DA_D10_P: ADC5G_DIGITALIO (IC2.E11), FMC (J4.c14)
DA_D11_N: ADC5G_DIGITALIO (IC2.F12), FMC (J4.d18)
DA_D11_P: ADC5G_DIGITALIO (IC2.F11), FMC (J4.d17)
DA_STR_N: ADC5G_DIGITALIO (IC2.H10), FMC (J4.d9)
DA_STR_P: ADC5G_DIGITALIO (IC2.H9), FMC (J4.d8)
DB_CLK_N: ADC5G_DIGITALIO (IC2.K10), FMC (J4.d21)
DB_CLK_P: ADC5G_DIGITALIO (IC2.K9), FMC (J4.d20)
DB_D0_N: ADC5G_DIGITALIO (IC2.T10), FMC (J4.g34)
DB_D0_P: ADC5G_DIGITALIO (IC2.T9), FMC (J4.g33)
DB_D1_N: ADC5G_DIGITALIO (IC2.R10), FMC (J4.g31)
DB_D1_P: ADC5G_DIGITALIO (IC2.R9), FMC (J4.g30)
DB_D2_N: ADC5G_DIGITALIO (IC2.P10), FMC (J4.h32)
DB_D2_P: ADC5G_DIGITALIO (IC2.P9), FMC (J4.h31)
DB_D3_N: ADC5G_DIGITALIO (IC2.N10), FMC (J4.h35)
DB_D3_P: ADC5G_DIGITALIO (IC2.N9), FMC (J4.h34)
DB_D4_N: ADC5G_DIGITALIO (IC2.M10), FMC (J4.h38)
DB_D4_P: ADC5G_DIGITALIO (IC2.M9), FMC (J4.h37)
DB_D5_N: ADC5G_DIGITALIO (IC2.L10), FMC (J4.h29)
DB_D5_P: ADC5G_DIGITALIO (IC2.L9), FMC (J4.h28)
DB_D6_N: ADC5G_DIGITALIO (IC2.T12), FMC (J4.g37)
DB_D6_P: ADC5G_DIGITALIO (IC2.T11), FMC (J4.g36)
DB_D7_N: ADC5G_DIGITALIO (IC2.R12), FMC (J4.c27)
DB_D7_P: ADC5G_DIGITALIO (IC2.R11), FMC (J4.c26)
DB_D8_N: ADC5G_DIGITALIO (IC2.P12), FMC (J4.h26)
DB_D8_P: ADC5G_DIGITALIO (IC2.P11), FMC (J4.h25)
DB_D9_N: ADC5G_DIGITALIO (IC2.N12), FMC (J4.g25)
DB_D9_P: ADC5G_DIGITALIO (IC2.N11), FMC (J4.g24)
DB_D10_N: ADC5G_DIGITALIO (IC2.M12), FMC (J4.d27)
DB_D10_P: ADC5G_DIGITALIO (IC2.M11), FMC (J4.d26)
DB_D11_N: ADC5G_DIGITALIO (IC2.L12), FMC (J4.d24)
DB_D11_P: ADC5G_DIGITALIO (IC2.L11), FMC (J4.d23)
DB_STR_N: ADC5G_DIGITALIO (IC2.J10), FMC (J4.c23)
DB_STR_P: ADC5G_DIGITALIO (IC2.J9), FMC (J4.c22)
DC_CLK_N: ADC5G_DIGITALIO (IC2.G16), FMC (J4.e3)
DC_CLK_P: ADC5G_DIGITALIO (IC2.G15), FMC (J4.e2)
DC_D0_N: ADC5G_DIGITALIO (IC2.A14), FMC (J4.k14)
DC_D0_P: ADC5G_DIGITALIO (IC2.A13), FMC (J4.k13)
DC_D1_N: ADC5G_DIGITALIO (IC2.B14), FMC (J4.f8)
DC_D1_P: ADC5G_DIGITALIO (IC2.B13), FMC (J4.f7)
DC_D2_N: ADC5G_DIGITALIO (IC2.C14), FMC (J4.j13)
DC_D2_P: ADC5G_DIGITALIO (IC2.C13), FMC (J4.j12)
DC_D3_N: ADC5G_DIGITALIO (IC2.D14), FMC (J4.k11)
DC_D3_P: ADC5G_DIGITALIO (IC2.D13), FMC (J4.k10)
DC_D4_N: ADC5G_DIGITALIO (IC2.E14), FMC (J4.j10)
DC_D4_P: ADC5G_DIGITALIO (IC2.E13), FMC (J4.j9)
DC_D5_N: ADC5G_DIGITALIO (IC2.F14), FMC (J4.k8)
DC_D5_P: ADC5G_DIGITALIO (IC2.F13), FMC (J4.k7)
DC_D6_N: ADC5G_DIGITALIO (IC2.G14), FMC (J4.j7)
DC_D6_P: ADC5G_DIGITALIO (IC2.G13), FMC (J4.j6)
DC_D7_N: ADC5G_DIGITALIO (IC2.B16), FMC (J4.f11)
DC_D7_P: ADC5G_DIGITALIO (IC2.B15), FMC (J4.f10)
DC_D8_N: ADC5G_DIGITALIO (IC2.C16), FMC (J4.e7)
DC_D8_P: ADC5G_DIGITALIO (IC2.C15), FMC (J4.e6)
DC_D9_N: ADC5G_DIGITALIO (IC2.D16), FMC (J4.f14)
DC_D9_P: ADC5G_DIGITALIO (IC2.D15), FMC (J4.f13)
DC_D10_N: ADC5G_DIGITALIO (IC2.E16), FMC (J4.e13)
DC_D10_P: ADC5G_DIGITALIO (IC2.E15), FMC (J4.e12)
DC_D11_N: ADC5G_DIGITALIO (IC2.F16), FMC (J4.e10)
DC_D11_P: ADC5G_DIGITALIO (IC2.F15), FMC (J4.e9)
DC_STR_N: ADC5G_DIGITALIO (IC2.H16), FMC (J4.f5)
DC_STR_P: ADC5G_DIGITALIO (IC2.H15), FMC (J4.f4)
DD_CLK_N: ADC5G_DIGITALIO (IC2.K16), FMC (J4.k29)
DD_CLK_P: ADC5G_DIGITALIO (IC2.K15), FMC (J4.k28)
DD_D0_N: ADC5G_DIGITALIO (IC2.T14), FMC (J4.f35)
DD_D0_P: ADC5G_DIGITALIO (IC2.T13), FMC (J4.f34)
DD_D1_N: ADC5G_DIGITALIO (IC2.R14), FMC (J4.f23)
DD_D1_P: ADC5G_DIGITALIO (IC2.R13), FMC (J4.f22)
DD_D2_N: ADC5G_DIGITALIO (IC2.P14), FMC (J4.e34)
DD_D2_P: ADC5G_DIGITALIO (IC2.P13), FMC (J4.e33)
DD_D3_N: ADC5G_DIGITALIO (IC2.N14), FMC (J4.k38)
DD_D3_P: ADC5G_DIGITALIO (IC2.N13), FMC (J4.k37)
DD_D4_N: ADC5G_DIGITALIO (IC2.M14), FMC (J4.f38)
DD_D4_P: ADC5G_DIGITALIO (IC2.M13), FMC (J4.f37)
DD_D5_N: ADC5G_DIGITALIO (IC2.L14), FMC (J4.e37)
DD_D5_P: ADC5G_DIGITALIO (IC2.L13), FMC (J4.e36)
DD_D6_N: ADC5G_DIGITALIO (IC2.K14), FMC (J4.e22)
DD_D6_P: ADC5G_DIGITALIO (IC2.K13), FMC (J4.e21)
DD_D7_N: ADC5G_DIGITALIO (IC2.R16), FMC (J4.e31)
DD_D7_P: ADC5G_DIGITALIO (IC2.R15), FMC (J4.e30)
DD_D8_N: ADC5G_DIGITALIO (IC2.P16), FMC (J4.e25)
DD_D8_P: ADC5G_DIGITALIO (IC2.P15), FMC (J4.e24)
DD_D9_N: ADC5G_DIGITALIO (IC2.N16), FMC (J4.f26)
DD_D9_P: ADC5G_DIGITALIO (IC2.N15), FMC (J4.f25)
DD_D10_N: ADC5G_DIGITALIO (IC2.M16), FMC (J4.e28)
DD_D10_P: ADC5G_DIGITALIO (IC2.M15), FMC (J4.e27)
DD_D11_N: ADC5G_DIGITALIO (IC2.L16), FMC (J4.j25)
DD_D11_P: ADC5G_DIGITALIO (IC2.L15), FMC (J4.j24)
DD_STR_N: ADC5G_DIGITALIO (IC2.J16), FMC (J4.k26)
DD_STR_P: ADC5G_DIGITALIO (IC2.J15), FMC (J4.k25)
DIN_N: TOP (J3.2), TDC (IC1.6)
DIN_P: TOP (J3.1), TDC (IC1.3)
DL_CH_N: TDC (IC1.30), U_TDC/TDC_DL_CH8 (C190H.1 D7H.4)
DL_CH_N: TDC (IC1.28), U_TDC/TDC_DL_CH7 (C190G.1 D7G.4)
DL_CH_N: TDC (IC1.26), U_TDC/TDC_DL_CH6 (C190F.1 D7F.4)
DL_CH_N: TDC (IC1.21), U_TDC/TDC_DL_CH5 (C190E.1 D7E.4)
DL_CH_N: TDC (IC1.19), U_TDC/TDC_DL_CH4 (C190D.1 D7D.4)
DL_CH_N: TDC (IC1.14), U_TDC/TDC_DL_CH3 (C190C.1 D7C.4)
DL_CH_N: TDC (IC1.12), U_TDC/TDC_DL_CH2 (C190B.1 D7B.4)
DL_CH_N: TDC (IC1.10), U_TDC/TDC_DL_CH1 (C190A.1 D7A.4)
DL_CH_P: TDC (IC1.31), U_TDC/TDC_DL_CH8 (C191H.1 D7H.3)
DL_CH_P: TDC (IC1.29), U_TDC/TDC_DL_CH7 (C191G.1 D7G.3)
DL_CH_P: TDC (IC1.27), U_TDC/TDC_DL_CH6 (C191F.1 D7F.3)
DL_CH_P: TDC (IC1.22), U_TDC/TDC_DL_CH5 (C191E.1 D7E.3)
DL_CH_P: TDC (IC1.20), U_TDC/TDC_DL_CH4 (C191D.1 D7D.3)
DL_CH_P: TDC (IC1.15), U_TDC/TDC_DL_CH3 (C191C.1 D7C.3)
DL_CH_P: TDC (IC1.13), U_TDC/TDC_DL_CH2 (C191B.1 D7B.3)
DL_CH_P: TDC (IC1.11), U_TDC/TDC_DL_CH1 (C191A.1 D7A.3)
DP1_M2C_N: FMC (J4.a3), U_TDC/TDC_DL_CH4 (D5D.1 L22D.2)
DP1_M2C_P: FMC (J4.a2), U_TDC/TDC_DL_CH4 (D5D.2 L25D.2)
DP2_M2C_N: FMC (J4.a7), U_TDC/TDC_DL_CH3 (D5C.1 L22C.2)
DP2_M2C_P: FMC (J4.a6), U_TDC/TDC_DL_CH3 (D5C.2 L25C.2)
DP3_M2C_N: FMC (J4.a11), U_TDC/TDC_DL_CH1 (D5A.1 L22A.2)
DP3_M2C_P: FMC (J4.a10), U_TDC/TDC_DL_CH1 (D5A.2 L25A.2)
DP4_M2C_N: FMC (J4.a15), U_TDC/TDC_DL_CH6 (D5F.1 L22F.2)
DP4_M2C_P: FMC (J4.a14), U_TDC/TDC_DL_CH6 (D5F.2 L25F.2)
DP5_M2C_N: FMC (J4.a19), U_TDC/TDC_DL_CH8 (D5H.1 L22H.2)
DP5_M2C_P: FMC (J4.a18), U_TDC/TDC_DL_CH8 (D5H.2 L25H.2)
DP6_M2C_N: FMC (J4.b17), U_TDC/TDC_DL_CH7 (D5G.1 L22G.2)
DP6_M2C_P: FMC (J4.b16), U_TDC/TDC_DL_CH7 (D5G.2 L25G.2)
DP7_M2C_N: FMC (J4.b13), U_TDC/TDC_DL_CH5 (D5E.1 L22E.2)
DP7_M2C_P: FMC (J4.b12), U_TDC/TDC_DL_CH5 (D5E.2 L25E.2)
DP8_M2C_N: FMC (J4.b9), U_TDC/TDC_DL_CH2 (D5B.1 L22B.2)
DP8_M2C_P: FMC (J4.b8), U_TDC/TDC_DL_CH2 (D5B.2 L25B.2)
GA0: FMC (J4.c34), FMC_EEPROM (IC15.2)
GA1: FMC (J4.d35), FMC_EEPROM (IC15.1)
GBTCLK0_M2C_N: ADC5G_PLL (C169.2), FMC (J4.d5)
GBTCLK0_M2C_P: ADC5G_PLL (C168.2), FMC (J4.d4)
HA14_P: ADC5G_PLL (IC16.6 IC16.7), FMC (J4.j15), TDC_VTUNE_DAC (IC18.16)
HA15_P: ADC5G_PLL (IC16.8), FMC (J4.f16), TDC_VTUNE_DAC (IC18.15)
HA17_CC_P: ADC5G_PLL (IC16.9), FMC (J4.k16), TDC_VTUNE_DAC (IC18.14)
HA18_P: ADC5G_PLL (R93.2 T2.5), FMC (J4.j18)
HA19_N: ADC5G_PLL (IC17.6), FMC (J4.f20)
HA19_P: ADC5G_PLL (IC17.7), FMC (J4.f19)
HA20_N: ADC5G_PLL (IC17.9), FMC (J4.e19)
HA20_P: ADC5G_PLL (IC17.8), FMC (J4.e18)
HA21_N: FMC (J4.k20), FMC_EEPROM (IC13.3 IC14.3 R78.1)
HA21_P: ADC5G_PLL (R94.2 T2.2), FMC (J4.k19)
HA22_P: FMC (J4.j21), TDC_VTUNE_DAC (IC18.24 R4.1)
HA23_P: FMC (J4.k22), TDC_VTUNE_DAC (IC18.13 R3.1)
HB11_P: ADC5G_FRONTEND (IC2.B8), FMC (J4.j30)
HB12_P: ADC5G_FRONTEND (IC2.A8), FMC (J4.f31)
HB14_P: ADC5G_FRONTEND (IC2.D8), FMC (J4.k34)
HB15_P: ADC5G_FRONTEND (IC2.C8), FMC (J4.j33)
LA20_P: FMC (J4.g21), USB_UART (U4.2)
LA25_P: FMC (J4.g27), USB_UART (U4.15)
NetC102_1: TOP (J2.1), ADC5G_PLL (C102.1 R31.2)
PG_M2C: FMC (J4.f1), LOCAL_POWER (R49.1 R52.2)
SCL: FMC (J4.c30), FMC_EEPROM (IC15.6 R80.2 R82.1 TP5.1), LOCAL_POWER (R90.2)
SDA: FMC (J4.c31), FMC_EEPROM (IC15.5 R79.2 R81.1 TP4.1), LOCAL_POWER (R89.2)
VCTRL_A_CH: U_TDC/TDC_DL_CH1 (5 pins), TDC_VTUNE_DAC (R115.2)
VCTRL_A_CH: U_TDC/TDC_DL_CH2 (5 pins), TDC_VTUNE_DAC (R114.2)
VCTRL_A_CH: U_TDC/TDC_DL_CH3 (5 pins), TDC_VTUNE_DAC (R113.2)
VCTRL_A_CH: U_TDC/TDC_DL_CH4 (5 pins), TDC_VTUNE_DAC (R112.2)
VCTRL_A_CH: U_TDC/TDC_DL_CH5 (5 pins), TDC_VTUNE_DAC (R111.2)
VCTRL_A_CH: U_TDC/TDC_DL_CH6 (5 pins), TDC_VTUNE_DAC (R110.2)
VCTRL_A_CH: U_TDC/TDC_DL_CH7 (5 pins), TDC_VTUNE_DAC (R109.2)
VCTRL_A_CH: U_TDC/TDC_DL_CH8 (5 pins), TDC_VTUNE_DAC (R108.2)